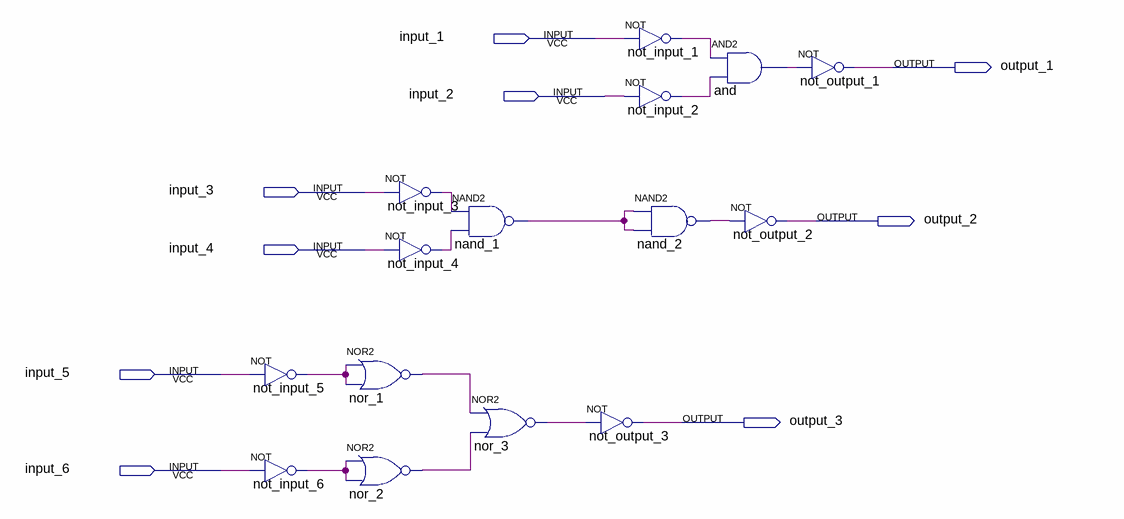
[diagram p0: schematic sheet]
// Quartus schematic lab3.bdf as structural Verilog: 15 symbols, 9 pins
module lab3 (
  input  input_1,
  input  input_2,
  input  input_3,
  input  input_4,
  input  input_5,
  input  input_6,
  output output_1,
  output output_2,
  output output_3
);

  wire and_out, nand_1_out, nand_2_out, nor_1_out, nor_2_out, nor_3_out, not_input_1_out, not_input_2_out,
       not_input_3_out, not_input_4_out, not_input_5_out, not_input_6_out;

  not not_input_5 (not_input_5_out, input_5);
  not not_input_6 (not_input_6_out, input_6);
  not not_input_3 (not_input_3_out, input_3);
  not not_input_4 (not_input_4_out, input_4);
  nor nor_1 (nor_1_out, not_input_5_out, not_input_5_out);
  nor nor_2 (nor_2_out, not_input_6_out, not_input_6_out);
  nand nand_1 (nand_1_out, not_input_3_out, not_input_4_out);
  nor nor_3 (nor_3_out, nor_1_out, nor_2_out);
  not not_input_1 (not_input_1_out, input_1);
  not not_input_2 (not_input_2_out, input_2);
  nand nand_2 (nand_2_out, nand_1_out, nand_1_out);
  not not_output_3 (output_3, nor_3_out);
  and \and  (and_out, not_input_1_out, not_input_2_out);
  not not_output_1 (output_1, and_out);
  not not_output_2 (output_2, nand_2_out);
endmodule
